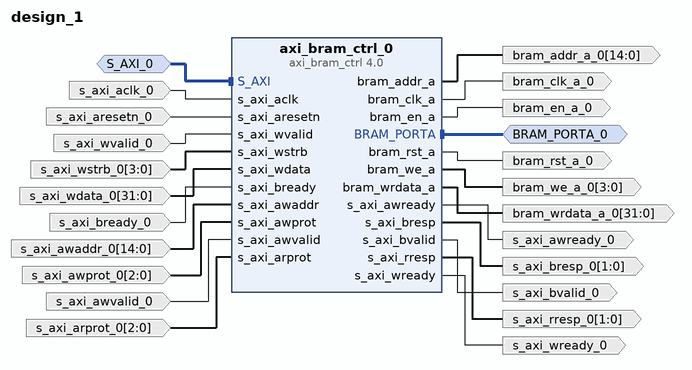
[diagram p0: block diagram of the top level]
# Vivado block design design_1, xc7a100tcsg324-1, Vivado 2018.2
create_bd_design design_1

create_bd_intf_port -mode Slave -vlnv xilinx.com:interface:aximm_rtl:1.0 S_AXI_0
set_property -dict [list \
  CONFIG.DATA_WIDTH 32 \
  CONFIG.PROTOCOL AXI4 \
  CONFIG.ID_WIDTH 0 \
  CONFIG.ADDR_WIDTH 15 \
  CONFIG.AWUSER_WIDTH 0 \
  CONFIG.ARUSER_WIDTH 0 \
  CONFIG.WUSER_WIDTH 0 \
  CONFIG.RUSER_WIDTH 0 \
  CONFIG.BUSER_WIDTH 0 \
  CONFIG.READ_WRITE_MODE READ_WRITE \
  CONFIG.HAS_BURST 1 \
  CONFIG.HAS_LOCK 1 \
  CONFIG.HAS_PROT 1 \
  CONFIG.HAS_CACHE 1 \
  CONFIG.HAS_QOS 0 \
  CONFIG.HAS_REGION 0 \
  CONFIG.HAS_WSTRB 1 \
  CONFIG.HAS_BRESP 1 \
  CONFIG.HAS_RRESP 1 \
  CONFIG.SUPPORTS_NARROW_BURST 1 \
  CONFIG.NUM_READ_OUTSTANDING 2 \
  CONFIG.NUM_WRITE_OUTSTANDING 2 \
  CONFIG.MAX_BURST_LENGTH 256 \
  CONFIG.NUM_READ_THREADS 1 \
  CONFIG.NUM_WRITE_THREADS 1 \
  CONFIG.RUSER_BITS_PER_BYTE 0 \
  CONFIG.WUSER_BITS_PER_BYTE 0 \
] [get_bd_intf_ports S_AXI_0]
create_bd_intf_port -mode Master -vlnv xilinx.com:interface:bram_rtl:1.0 BRAM_PORTA_0
set_property -dict {CONFIG.MASTER_TYPE BRAM_CTRL CONFIG.READ_WRITE_MODE WRITE_ONLY} [get_bd_intf_ports BRAM_PORTA_0]
create_bd_port -dir I -type clk s_axi_aclk_0
create_bd_port -dir I -type rst s_axi_aresetn_0
create_bd_port -dir I s_axi_wvalid_0
create_bd_port -dir I -from 3 -to 0 s_axi_wstrb_0
create_bd_port -dir O s_axi_wready_0
create_bd_port -dir I -from 31 -to 0 s_axi_wdata_0
create_bd_port -dir O -from 1 -to 0 s_axi_rresp_0
create_bd_port -dir O s_axi_bvalid_0
create_bd_port -dir O -from 1 -to 0 s_axi_bresp_0
create_bd_port -dir I s_axi_bready_0
create_bd_port -dir I -from 14 -to 0 s_axi_awaddr_0
create_bd_port -dir I -from 2 -to 0 s_axi_awprot_0
create_bd_port -dir O s_axi_awready_0
create_bd_port -dir I s_axi_awvalid_0
create_bd_port -dir I -from 2 -to 0 s_axi_arprot_0
create_bd_port -dir O -from 14 -to 0 bram_addr_a_0
create_bd_port -dir O -type clk bram_clk_a_0
create_bd_port -dir O -from 31 -to 0 bram_wrdata_a_0
create_bd_port -dir O bram_en_a_0
create_bd_port -dir O -type rst bram_rst_a_0
create_bd_port -dir O -from 3 -to 0 bram_we_a_0

create_bd_cell -type ip -vlnv xilinx.com:ip:axi_bram_ctrl:4.0 axi_bram_ctrl_0
set_property -dict {CONFIG.PROTOCOL AXI4LITE CONFIG.SINGLE_PORT_BRAM 1} [get_bd_cells axi_bram_ctrl_0]

# ---- connections ----

connect_bd_intf_net -intf_net S_AXI_0_1 [get_bd_intf_ports S_AXI_0] [get_bd_intf_pins axi_bram_ctrl_0/S_AXI]
connect_bd_intf_net [get_bd_intf_ports BRAM_PORTA_0] [get_bd_intf_pins axi_bram_ctrl_0/BRAM_PORTA]
connect_bd_net -net s_axi_aclk_0_1 [get_bd_ports s_axi_aclk_0] [get_bd_pins axi_bram_ctrl_0/s_axi_aclk]
connect_bd_net -net s_axi_aresetn_0_1 [get_bd_ports s_axi_aresetn_0] [get_bd_pins axi_bram_ctrl_0/s_axi_aresetn]
connect_bd_net -net s_axi_wvalid_0_1 [get_bd_ports s_axi_wvalid_0] [get_bd_pins axi_bram_ctrl_0/s_axi_wvalid]
connect_bd_net -net s_axi_wstrb_0_1 [get_bd_ports s_axi_wstrb_0] [get_bd_pins axi_bram_ctrl_0/s_axi_wstrb]
connect_bd_net [get_bd_pins axi_bram_ctrl_0/s_axi_wready] [get_bd_ports s_axi_wready_0]
connect_bd_net -net s_axi_wdata_0_1 [get_bd_ports s_axi_wdata_0] [get_bd_pins axi_bram_ctrl_0/s_axi_wdata]
connect_bd_net [get_bd_pins axi_bram_ctrl_0/s_axi_rresp] [get_bd_ports s_axi_rresp_0]
connect_bd_net [get_bd_pins axi_bram_ctrl_0/s_axi_bvalid] [get_bd_ports s_axi_bvalid_0]
connect_bd_net [get_bd_pins axi_bram_ctrl_0/s_axi_bresp] [get_bd_ports s_axi_bresp_0]
connect_bd_net -net s_axi_bready_0_1 [get_bd_ports s_axi_bready_0] [get_bd_pins axi_bram_ctrl_0/s_axi_bready]
connect_bd_net -net s_axi_awaddr_0_1 [get_bd_ports s_axi_awaddr_0] [get_bd_pins axi_bram_ctrl_0/s_axi_awaddr]
connect_bd_net -net s_axi_awprot_0_1 [get_bd_ports s_axi_awprot_0] [get_bd_pins axi_bram_ctrl_0/s_axi_awprot]
connect_bd_net [get_bd_pins axi_bram_ctrl_0/s_axi_awready] [get_bd_ports s_axi_awready_0]
connect_bd_net -net s_axi_awvalid_0_1 [get_bd_ports s_axi_awvalid_0] [get_bd_pins axi_bram_ctrl_0/s_axi_awvalid]
connect_bd_net -net s_axi_arprot_0_1 [get_bd_ports s_axi_arprot_0] [get_bd_pins axi_bram_ctrl_0/s_axi_arprot]
connect_bd_net [get_bd_pins axi_bram_ctrl_0/bram_addr_a] [get_bd_ports bram_addr_a_0]
connect_bd_net [get_bd_pins axi_bram_ctrl_0/bram_clk_a] [get_bd_ports bram_clk_a_0]
connect_bd_net [get_bd_pins axi_bram_ctrl_0/bram_wrdata_a] [get_bd_ports bram_wrdata_a_0]
connect_bd_net [get_bd_pins axi_bram_ctrl_0/bram_en_a] [get_bd_ports bram_en_a_0]
connect_bd_net [get_bd_pins axi_bram_ctrl_0/bram_rst_a] [get_bd_ports bram_rst_a_0]
connect_bd_net [get_bd_pins axi_bram_ctrl_0/bram_we_a] [get_bd_ports bram_we_a_0]

validate_bd_design
save_bd_design
